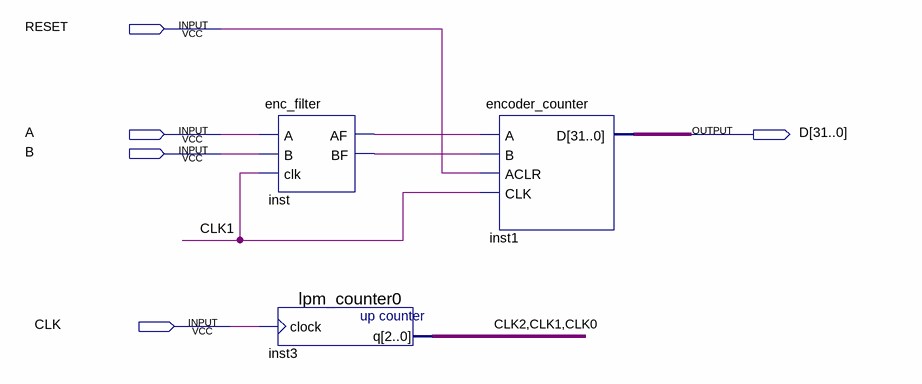
[diagram p0: schematic sheet]
// Quartus schematic encoder.bdf as structural Verilog: 3 symbols, 5 pins
module encoder (
  input  RESET,
  input  A,
  input  B,
  input  CLK,
  output [31:0] D
);

  wire CLK0, CLK1, CLK2, inst_af, inst_bf;

  enc_filter inst (.A(A), .B(B), .clk(CLK1), .AF(inst_af), .BF(inst_bf));
  lpm_counter0 inst3 (.clock(CLK), .q({CLK2, CLK1, CLK0}));
  encoder_counter inst1 (.A(inst_af), .B(inst_bf), .ACLR(RESET), .CLK(CLK1), .D(D));
endmodule
